# Altium schematic sheet HAE.SchDoc
size A; SheetNumber: 1; SheetTotal: 6
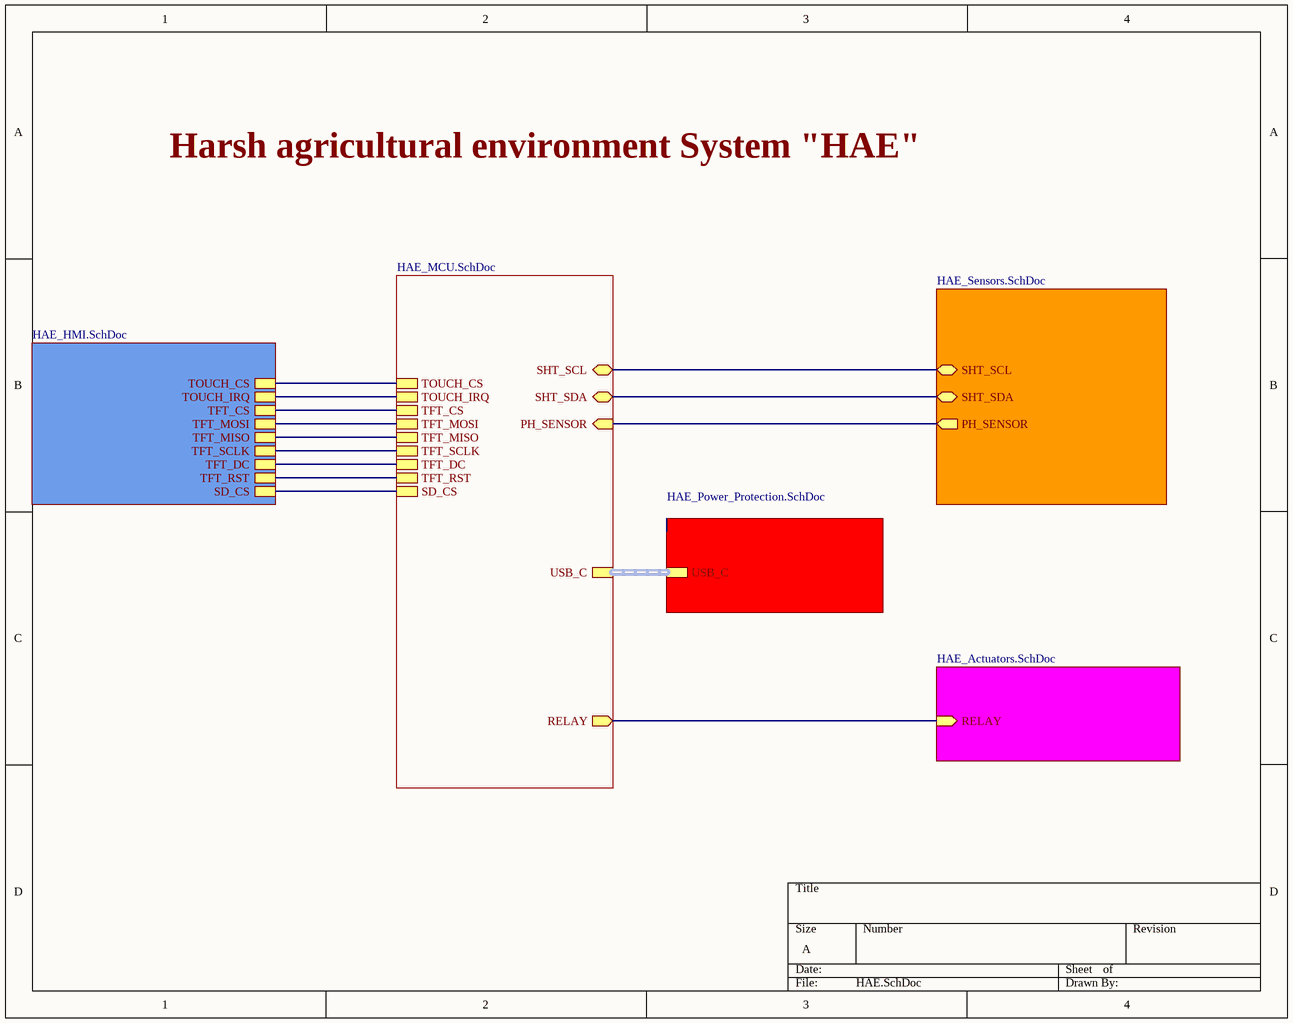
[diagram p0: HAE.SchDoc]

## Sub-sheets
Designator = HAE_Sensors.SchDoc: PH_SENSOR (out), SHT_SDA (bidir), SHT_SCL (bidir)
Designator = HAE_MCU.SchDoc: USB_C (harness USB_C), RELAY (out), TOUCH_CS, TOUCH_IRQ, TFT_CS, TFT_MOSI, TFT_MISO, TFT_SCLK, TFT_DC, TFT_RST, SD_CS, PH_SENSOR (in), SHT_SDA (bidir), SHT_SCL (bidir)
Designator = HAE_Power_Protection.SchDoc: USB_C (harness USB_C)
Designator = HAE_Actuators.SchDoc: RELAY (in)
Designator = HAE_HMI.SchDoc: TOUCH_CS, TOUCH_IRQ, TFT_CS, TFT_MOSI, TFT_MISO, TFT_SCLK, TFT_DC, TFT_RST, SD_CS

## Nets
(unnamed): sheet Designator/PH_SENSOR, sheet Designator/PH_SENSOR
(unnamed): sheet Designator/SHT_SDA, sheet Designator/SHT_SDA
(unnamed): sheet Designator/SHT_SCL, sheet Designator/SHT_SCL
(unnamed): sheet Designator/RELAY, sheet Designator/RELAY
(unnamed): sheet Designator/TOUCH_CS, sheet Designator/TOUCH_CS
(unnamed): sheet Designator/TOUCH_IRQ, sheet Designator/TOUCH_IRQ
(unnamed): sheet Designator/TFT_CS, sheet Designator/TFT_CS
(unnamed): sheet Designator/TFT_MOSI, sheet Designator/TFT_MOSI
(unnamed): sheet Designator/TFT_MISO, sheet Designator/TFT_MISO
(unnamed): sheet Designator/TFT_SCLK, sheet Designator/TFT_SCLK
(unnamed): sheet Designator/TFT_DC, sheet Designator/TFT_DC
(unnamed): sheet Designator/TFT_RST, sheet Designator/TFT_RST
(unnamed): sheet Designator/SD_CS, sheet Designator/SD_CS

## Notes on the sheet
- Harsh agricultural environment System "HAE"